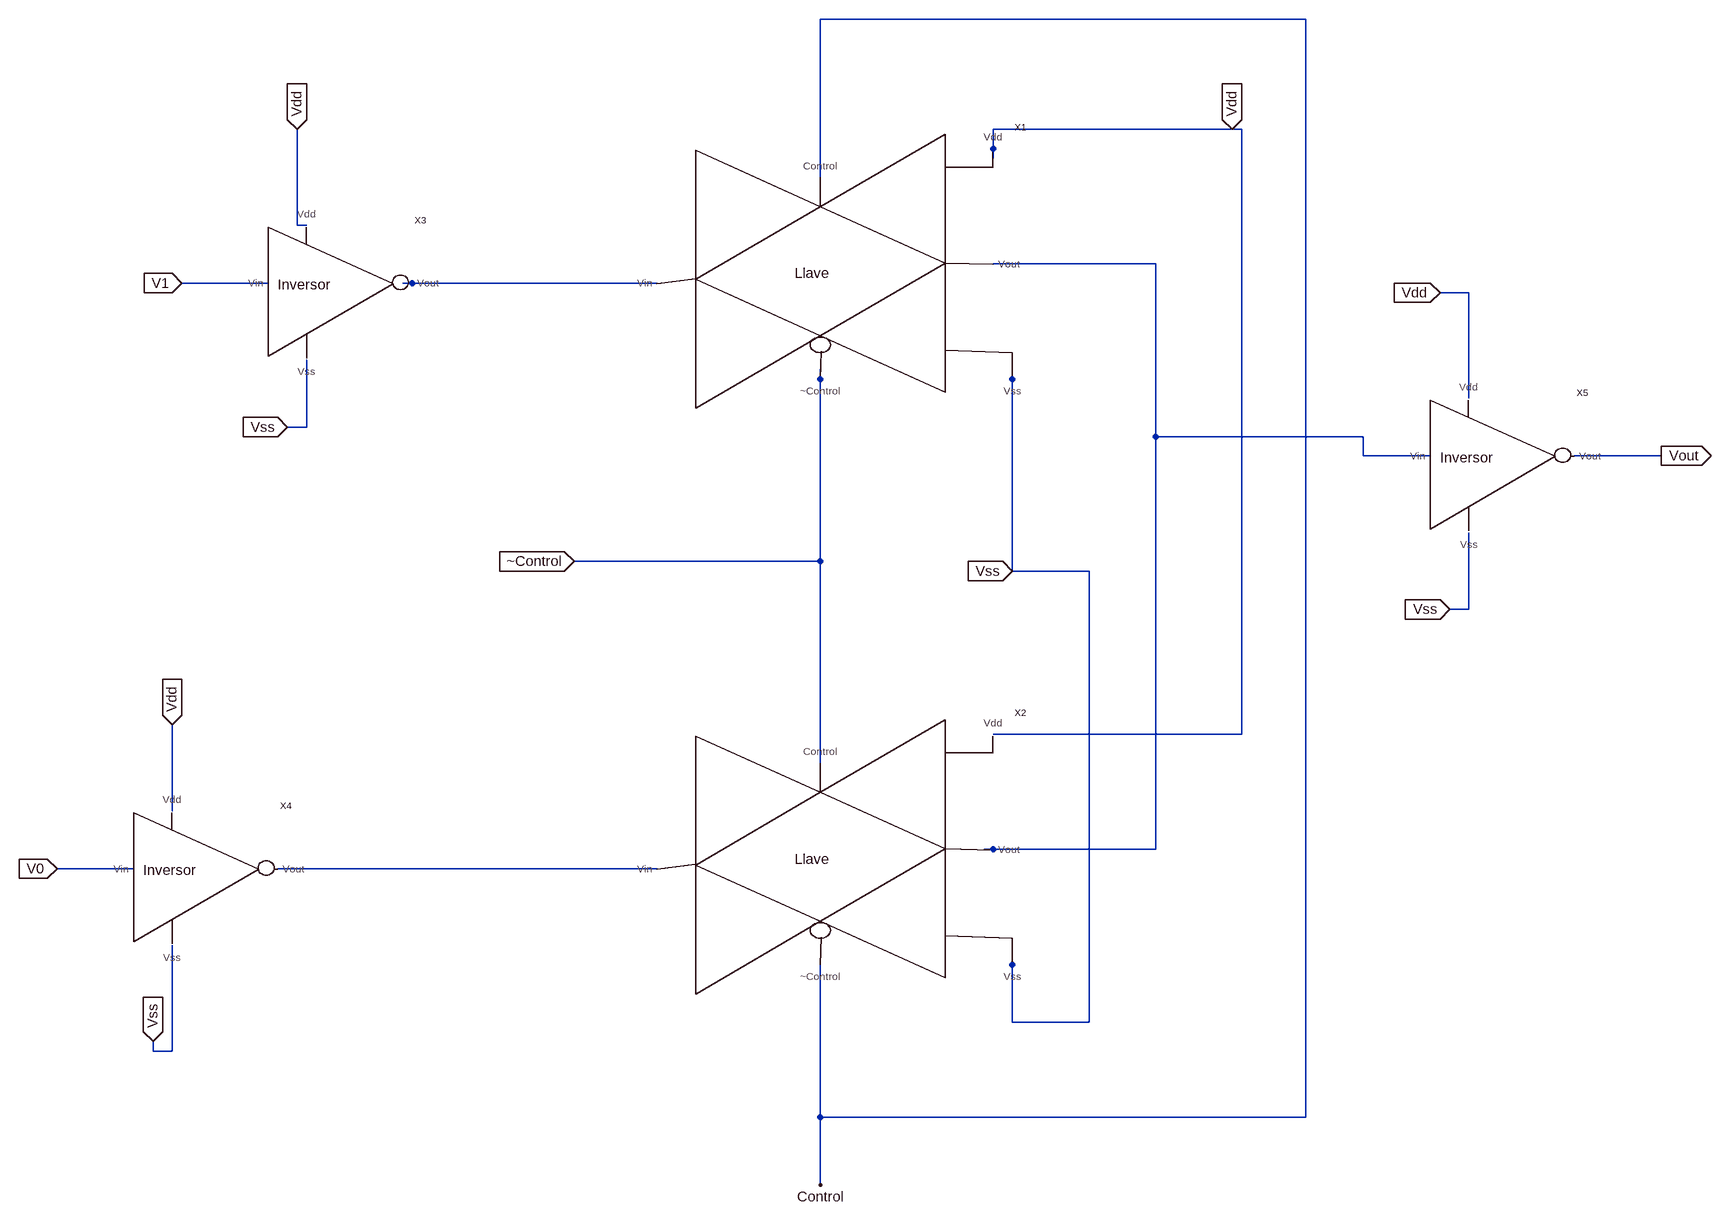
[diagram p0: schematic mux.asc]
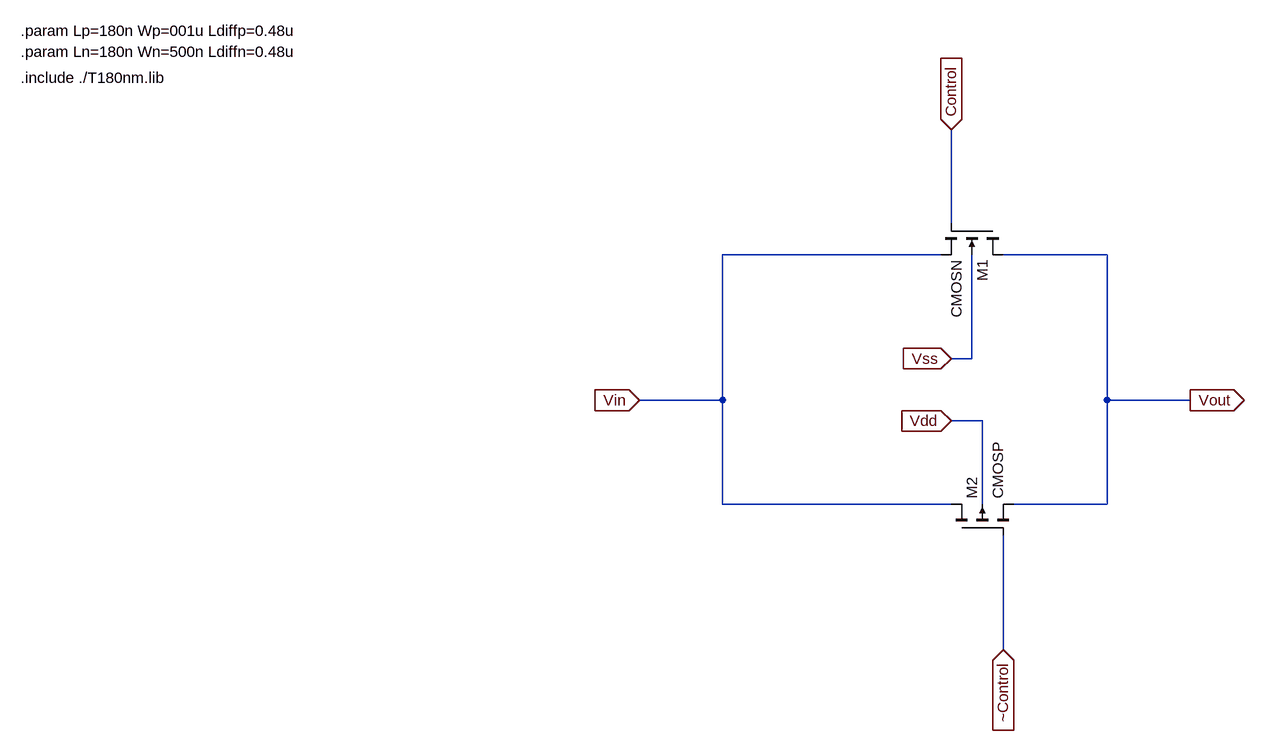
[diagram p1: sub-circuit transgate.asc]
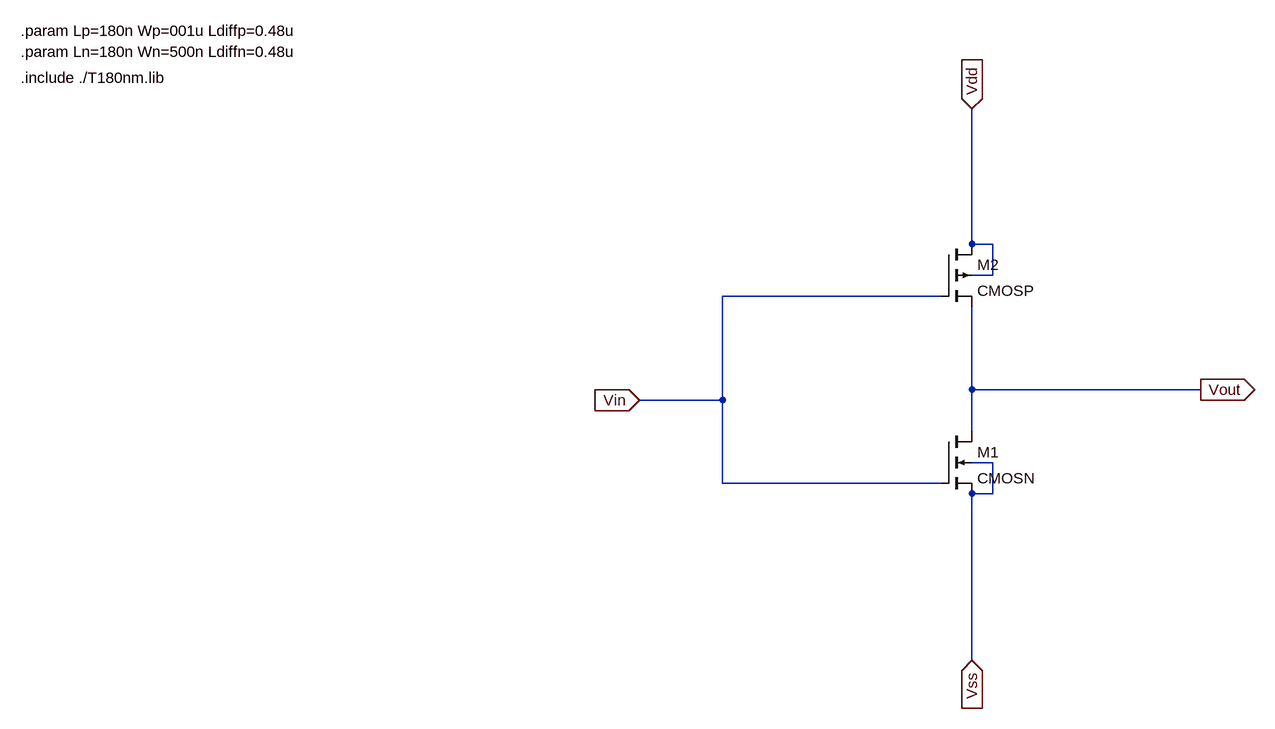
[diagram p2: sub-circuit inversor.asc]
mux.asc, the LTspice schematic file:
Version 4
SHEET 1 1664 1760
WIRE 944 -1056 -608 -1056
WIRE 608 -784 -320 -784
WIRE 624 -784 608 -784
WIRE -320 -752 -320 -784
WIRE -320 -736 -320 -752
WIRE -608 -704 -608 -1056
WIRE -1712 -624 -1712 -784
WIRE -1696 -624 -1712 -624
WIRE 384 -560 -320 -560
WIRE -1760 -528 -1904 -528
WIRE -1520 -528 -1536 -528
WIRE -880 -528 -1520 -528
WIRE 1216 -512 1168 -512
WIRE -608 -368 -608 -384
WIRE -288 -368 -288 -384
WIRE 1216 -336 1216 -512
WIRE -1696 -288 -1696 -400
WIRE -1696 -288 -1728 -288
WIRE 384 -272 384 -560
WIRE 1040 -272 384 -272
WIRE 1040 -240 1040 -272
WIRE 1152 -240 1040 -240
WIRE 1552 -240 1392 -240
WIRE -608 -64 -608 -368
WIRE -608 -64 -1072 -64
WIRE -288 -48 -288 -368
WIRE 128 -48 -288 -48
WIRE 1216 16 1216 -112
WIRE 1216 16 1184 16
WIRE 624 224 624 -784
WIRE 624 224 -320 224
WIRE -608 272 -608 -64
WIRE -1920 352 -1920 208
WIRE -320 416 -336 416
WIRE 384 416 384 -272
WIRE 384 416 -320 416
WIRE -1984 448 -2112 448
WIRE -880 448 -1744 448
WIRE -288 608 -288 592
WIRE -288 704 -288 608
WIRE 128 704 128 -48
WIRE 128 704 -288 704
WIRE -1952 752 -1952 736
WIRE -1920 752 -1920 576
WIRE -1920 752 -1952 752
WIRE -608 1344 -608 608
WIRE 944 1344 944 -1056
WIRE 944 1344 -608 1344
WIRE -608 1632 -608 1344
FLAG -1072 -64 ~Control
IOPIN -1072 -64 In
FLAG -288 -48 Vss
IOPIN -288 -48 In
FLAG 608 -784 Vdd
IOPIN 608 -784 In
FLAG -608 1632 Control
FLAG -1904 -528 V1
IOPIN -1904 -528 In
FLAG -2112 448 V0
IOPIN -2112 448 In
FLAG -1712 -784 Vdd
IOPIN -1712 -784 In
FLAG -1728 -288 Vss
IOPIN -1728 -288 In
FLAG -1920 208 Vdd
IOPIN -1920 208 In
FLAG -1952 736 Vss
IOPIN -1952 736 In
FLAG 1168 -512 Vdd
IOPIN 1168 -512 In
FLAG 1184 16 Vss
IOPIN 1184 16 In
FLAG 1552 -240 Vout
IOPIN 1552 -240 Out
SYMBOL transgate -624 -544 R0
SYMATTR InstName X1
SYMBOL transgate -624 432 R0
SYMATTR InstName X2
SYMBOL inversor -1696 -528 R0
SYMATTR InstName X3
SYMBOL inversor -1920 448 R0
SYMATTR InstName X4
SYMBOL inversor 1216 -240 R0
SYMATTR InstName X5

transgate.asc, the sub-circuit schematic file:
Version 4
SHEET 1 880 712
WIRE 192 -128 192 -272
WIRE 176 -80 -160 -80
WIRE 432 -80 272 -80
WIRE 224 80 224 -80
WIRE 224 80 192 80
WIRE -160 144 -160 -80
WIRE -160 144 -288 144
WIRE 432 144 432 -80
WIRE 560 144 432 144
WIRE 240 176 192 176
WIRE -160 304 -160 144
WIRE 192 304 -160 304
WIRE 240 304 240 176
WIRE 432 304 432 144
WIRE 432 304 288 304
WIRE 272 528 272 352
FLAG -288 144 Vin
IOPIN -288 144 In
FLAG 560 144 Vout
IOPIN 560 144 Out
FLAG 192 -272 Control
IOPIN 192 -272 In
FLAG 272 528 ~Control
IOPIN 272 528 In
FLAG 192 176 Vdd
IOPIN 192 176 In
FLAG 192 80 Vss
IOPIN 192 80 In
SYMBOL nmos4 272 -128 R90
SYMATTR InstName M1
SYMATTR Value CMOSN
SYMATTR Value2 l={Ln} w={Wn} ad={Ldiffn*Wn} as={Ldiffn*Wn} pd={2*Ldiffn+Wn} ps={2*Ldiffn+Wn}
SYMBOL pmos4 192 352 R270
SYMATTR InstName M2
SYMATTR Value CMOSP
SYMATTR Value2 l={Lp} w={Wp} ad={Ldiffp*Wp} as={Ldiffp*Wp} pd={2*Ldiffp+Wp} ps={2*Ldiffp+Wp}
TEXT -1240 -352 Left 2 !.include ./T180nm.lib
TEXT -1240 -424 Left 2 !.param Lp=180n Wp=001u Ldiffp=0.48u
TEXT -1240 -392 Left 2 !.param Ln=180n Wn=500n Ldiffn=0.48u

inversor.asc, the sub-circuit schematic file:
Version 4
SHEET 1 880 712
WIRE 224 -96 224 -304
WIRE 256 -96 224 -96
WIRE 256 -48 256 -96
WIRE 256 -48 224 -48
WIRE 176 -16 -160 -16
WIRE 224 128 224 0
WIRE 576 128 224 128
WIRE -160 144 -160 -16
WIRE -160 144 -288 144
WIRE 224 192 224 128
WIRE 256 240 224 240
WIRE -160 272 -160 144
WIRE 176 272 -160 272
WIRE 256 288 256 240
WIRE 256 288 224 288
WIRE 224 544 224 288
FLAG -288 144 Vin
IOPIN -288 144 In
FLAG 576 128 Vout
IOPIN 576 128 Out
FLAG 224 -304 Vdd
IOPIN 224 -304 In
FLAG 224 544 Vss
IOPIN 224 544 In
SYMBOL nmos4 176 192 R0
SYMATTR InstName M1
SYMATTR Value CMOSN
SYMATTR Value2 l={Ln} w={Wn} ad={Ldiffn*Wn} as={Ldiffn*Wn} pd={2*Ldiffn+Wn} ps={2*Ldiffn+Wn}
SYMBOL pmos4 176 -96 R0
SYMATTR InstName M2
SYMATTR Value CMOSP
SYMATTR Value2 l={Lp} w={Wp} ad={Ldiffp*Wp} as={Ldiffp*Wp} pd={2*Ldiffp+Wp} ps={2*Ldiffp+Wp}
TEXT -1240 -352 Left 2 !.include ./T180nm.lib
TEXT -1240 -424 Left 2 !.param Lp=180n Wp=001u Ldiffp=0.48u
TEXT -1240 -392 Left 2 !.param Ln=180n Wn=500n Ldiffn=0.48u

The netlist it stands for:
* mux.asc
XX1 N002 Vdd Vss N001 Control ~Control transgate
XX2 N003 Vdd Vss N001 ~Control Control transgate
XX3 V1 Vdd Vss N002 inversor
XX4 V0 Vdd Vss N003 inversor
XX5 N001 Vdd Vss Vout inversor

* block symbol definitions
.subckt transgate Vin Vdd Vss Vout Control ~Control
M1 Vout Control Vin Vss CMOSN l={Ln} w={Wn} ad={Ldiffn*Wn} as={Ldiffn*Wn} pd={2*Ldiffn+Wn} ps={2*Ldiffn+Wn}
M2 Vin ~Control Vout Vdd CMOSP l={Lp} w={Wp} ad={Ldiffp*Wp} as={Ldiffp*Wp} pd={2*Ldiffp+Wp} ps={2*Ldiffp+Wp}
.include ./T180nm.lib
.param Lp=180n Wp=001u Ldiffp=0.48u
.param Ln=180n Wn=500n Ldiffn=0.48u
.ends transgate

.subckt inversor Vin Vdd Vss Vout
M1 Vout Vin Vss Vss CMOSN l={Ln} w={Wn} ad={Ldiffn*Wn} as={Ldiffn*Wn} pd={2*Ldiffn+Wn} ps={2*Ldiffn+Wn}
M2 Vdd Vin Vout Vdd CMOSP l={Lp} w={Wp} ad={Ldiffp*Wp} as={Ldiffp*Wp} pd={2*Ldiffp+Wp} ps={2*Ldiffp+Wp}
.include ./T180nm.lib
.param Lp=180n Wp=001u Ldiffp=0.48u
.param Ln=180n Wn=500n Ldiffn=0.48u
.ends inversor

.model NMOS NMOS
.model PMOS PMOS
.lib standard.mos
.backanno
.end